# EAGLE schematic energy-monitor-cpbr7 (EAGLE 6.5.0)
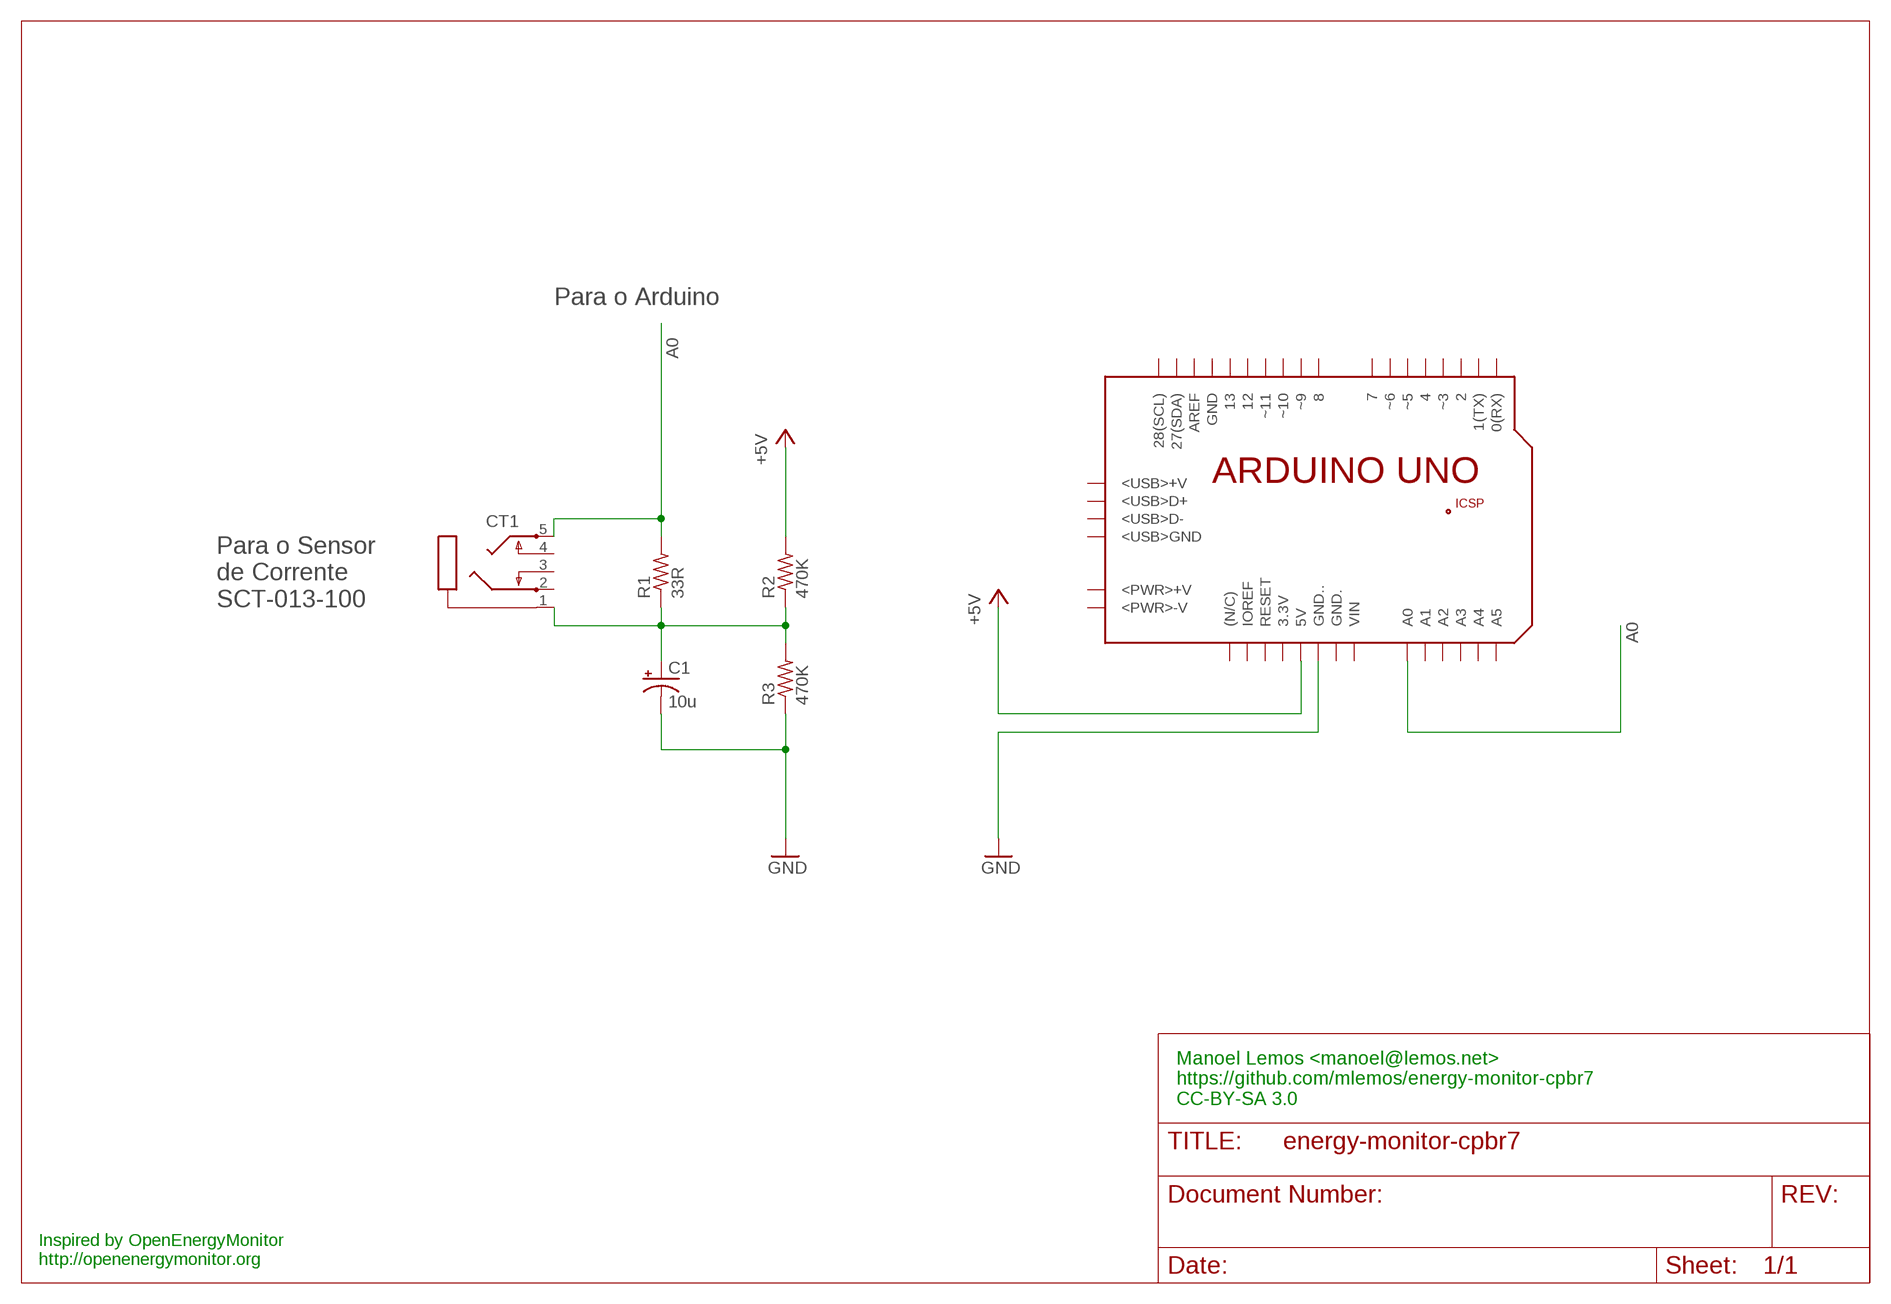
[diagram p0: schematic, sheet 1]

## Parts
C1  10u  CPOL-USE2,5-6E  [E2,5-6E]
CT1  STEREOJACK  [STX3100]
PCB2  ARDUINO_UNO_EXT  (no package)
R1  33R  R-US_0207/2V  [0207/2V]
R2  470K  R-US_0207/2V  [0207/2V]
R3  470K  R-US_0207/2V  [0207/2V]

## Nets
+5V: PCB2.5V R2.2
A0: CT1.5 PCB2.A0 R1.2
GND: C1.- PCB2.GND.. R3.1
N$1: C1.+ CT1.1 R1.1 R2.1 R3.2
Unconnected: CT1.2 CT1.3 CT1.4 PCB2.0(RX) PCB2.1(TX) PCB2.2 PCB2.3.3V PCB2.4 PCB2.7 PCB2.8 PCB2.12 PCB2.13 PCB2.27(SDA) PCB2.28(SCL) PCB2.(N/C) PCB2.+5V PCB2.<PWR>+V PCB2.<PWR>-V PCB2.<USB>+V PCB2.<USB>D+ PCB2.<USB>D- PCB2.<USB>GND PCB2.A1 PCB2.A2 PCB2.A3 PCB2.A4 PCB2.A5 PCB2.AREF PCB2.GND PCB2.GND. PCB2.GND_ PCB2.IOREF PCB2.MISO PCB2.MOSI PCB2.RESET PCB2.RESET. PCB2.SCK PCB2.VIN PCB2.~3 PCB2.~5 PCB2.~6 PCB2.~9 PCB2.~10 PCB2.~11

## Notes on the sheet
- Para o Arduino
- Para o Sensor
  de Corrente
  SCT-013-100
- Manoel Lemos <manoel@lemos.net>
  https://github.com/mlemos/energy-monitor-cpbr7
  CC-BY-SA 3.0
- Inspired by OpenEnergyMonitor
  http://openenergymonitor.org

## Library data of the parts
C1 = rcl:CPOL-US: POLARIZED CAPACITOR, American symbol
CT1 = adafruit:STEREOJACK: MIC/HEADPHONE JACK Stereo jack with two switches. Kycon STX3100, CUI SJ1-3555NG and/or 4UCon 05544
PCB2 = E14_Arduino:ARDUINO_UNO_EXT: Device for representing an Arduino Uno board in an EAGLE design without the PCB footprint. Created by Dave Young for Element14. More EAGLE documentation at: http://www.element14.com/community/community/knode/cadsoft_eagle
R1-R3 = rcl:R-US_: RESISTOR, American symbol

## Net classes
0 default: clearance 0.205 mm